# EAGLE board backplane (EAGLE 8.3.1), part 1 of 3
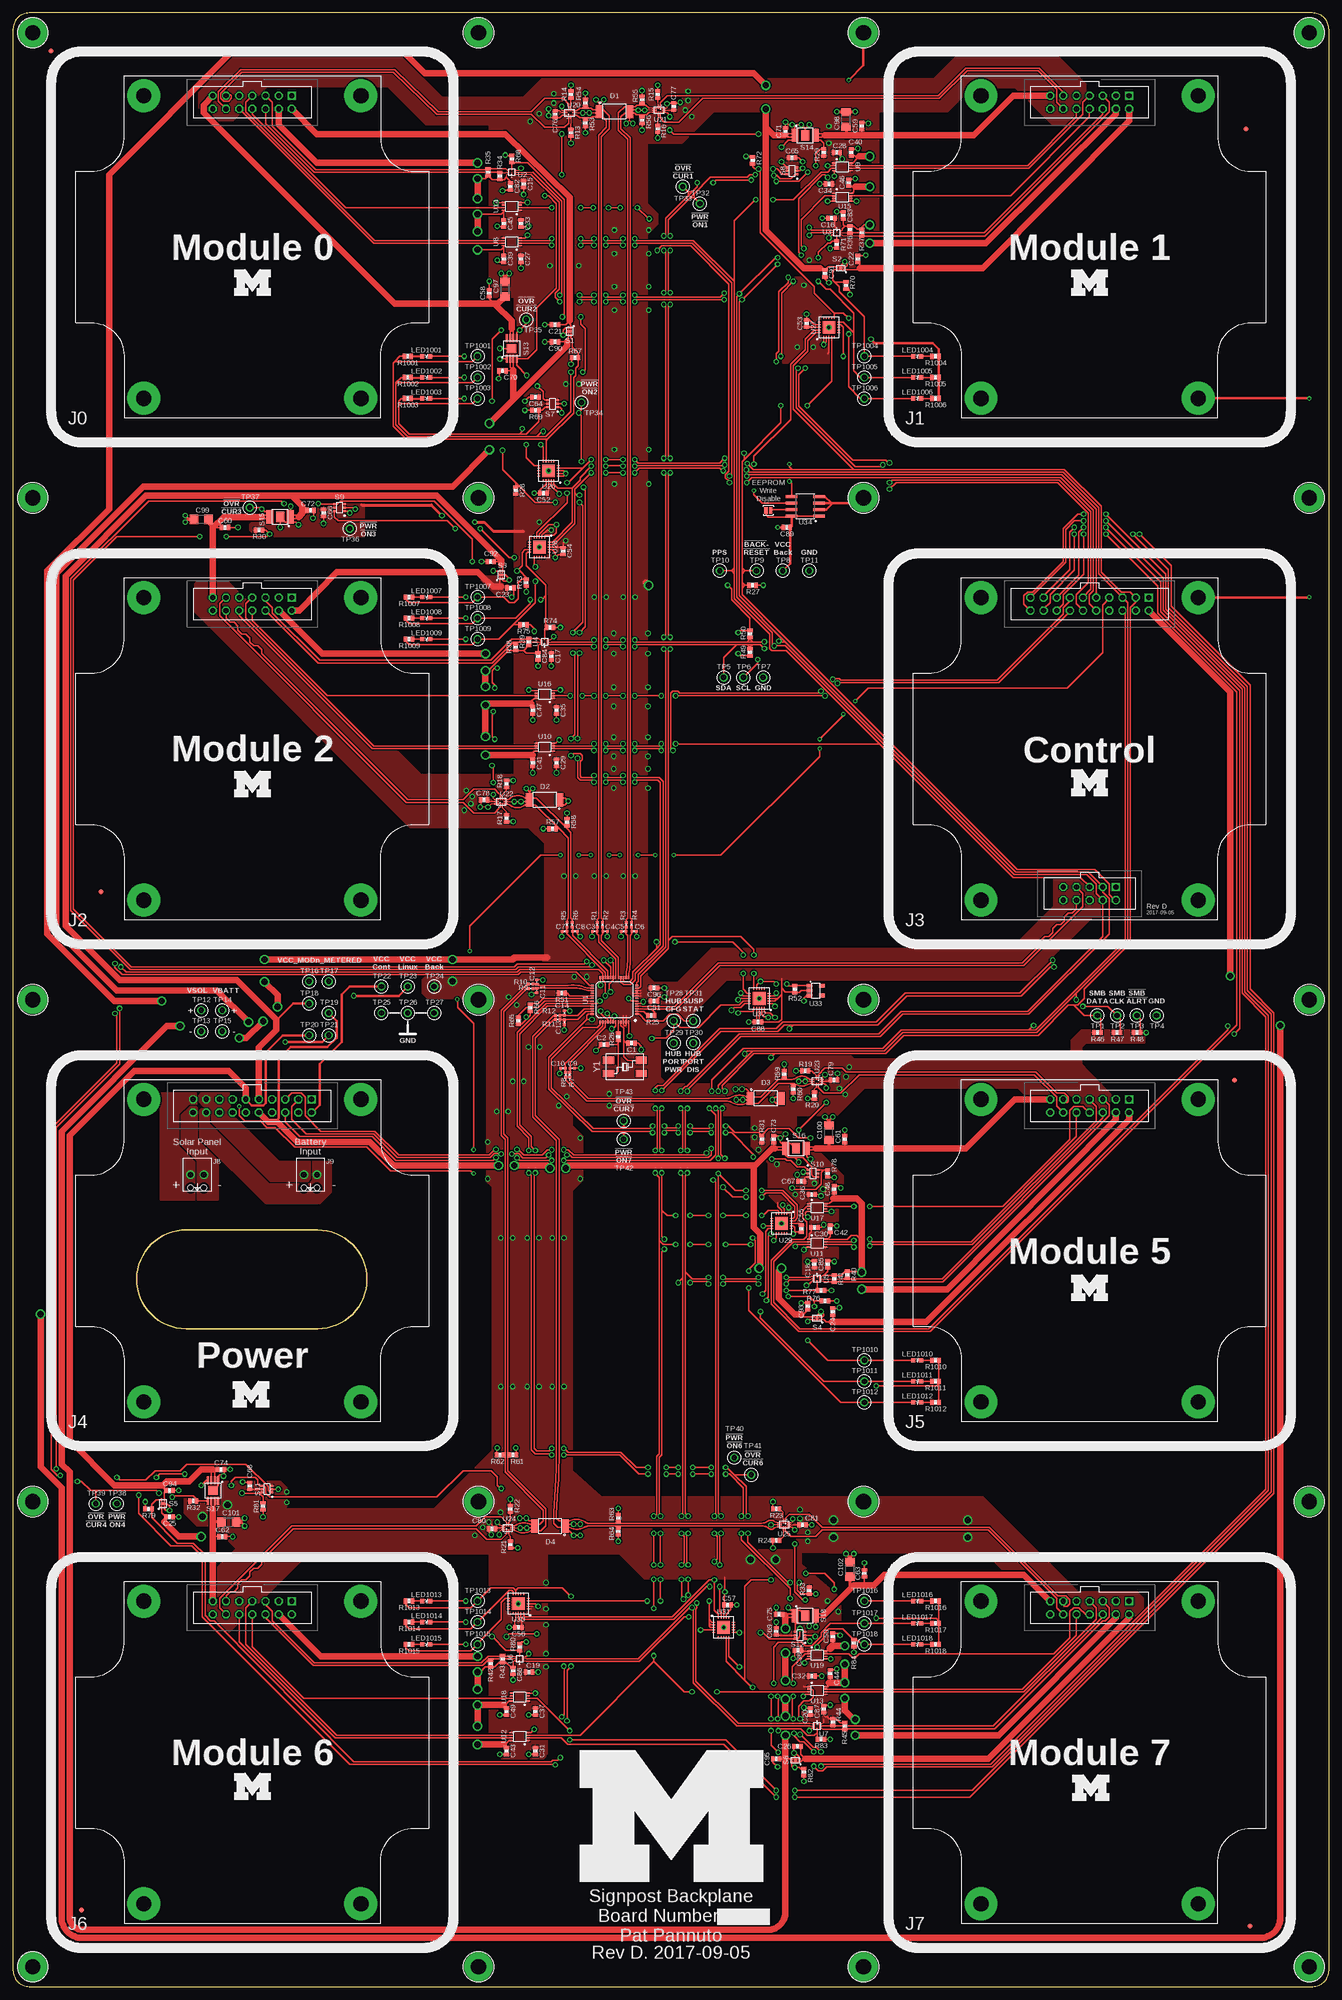
[diagram p10: board, top side]
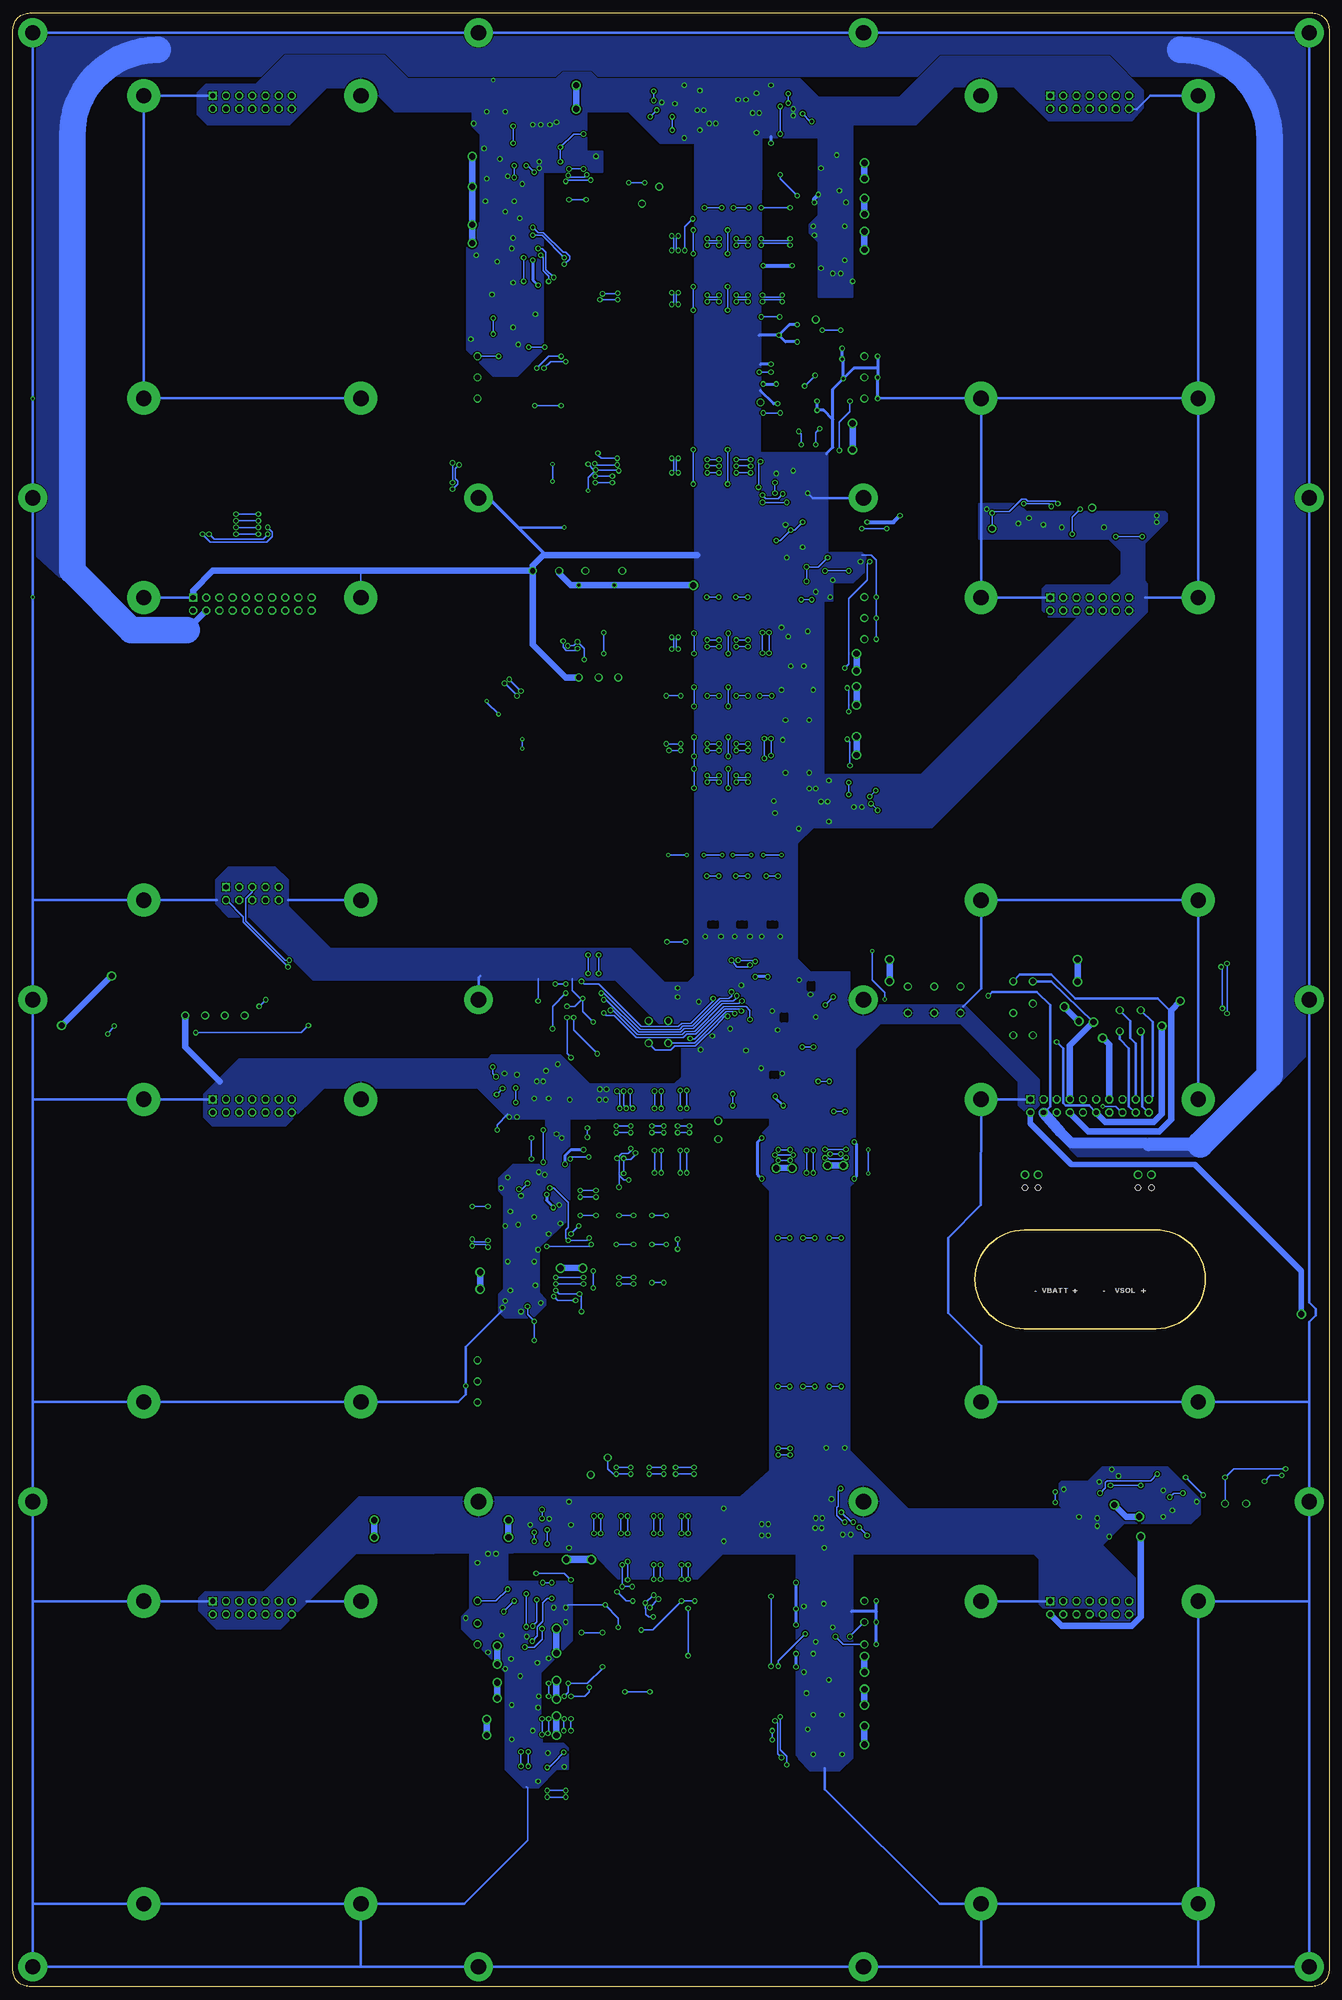
[diagram p11: board, bottom side, seen from below]

Size 254 x 381 mm. Coordinates in mm from the lower left corner, seen from the top.
Outline: 33.4,146.05 33.53,146.05
Outline: 33.53,146.05 58.8,146.05 arc-180 58.8,127 33.4,127 arc-181 33.53,146.05
Outline: 0,377.82 0,3.17 arc90 3.17,0 250.82,0 arc90 254,3.17 254,377.76 arc90 250.76,381 3.17,381 arc90 0,377.82
Copper layers (1*16): Top 0.0178mm / dielectric 59mil / Bottom 0.0178mm
Design rules "sunstone-2lyr_v1.0.0.3 *": minimum track width 6mil, minimum drill 14mil, track to track 6mil, track to pad 6mil, pad to pad 6mil, via to via 6mil, smd to smd 6mil, copper to edge 20mil, drill to drill 16mil, minimum pad ring 8mil, minimum via ring 8mil, stop-mask expansion 3mil, vias tented up to drill 50mil, thermal gap 10mil
tRestrict: area 120.2,191.5 to 120.5,191.5; area 118,186.1 to 118.1,186.4; area 99.2,73.1 to 99.6,73.2; area 99.2,72.6 to 99.6,72.7

## Footprints (pad centres in the part's own frame; a part is rotated, then mirrored left to right if it is on the bottom)
0603_CAP = smd 0.7 x 1: 1 -0.65,0; 2 0.65,0
0402_CAP = smd 0.536 x 0.546: 1 -0.433,0; 2 0.433,0
C1206 = smd 1.6 x 1.8: 1 -1.4,0; 2 1.4,0
TSSOP-8 = smd 1.5 x 0.45: 1 -2.9,0.975; 2 -2.9,0.325; 3 -2.9,-0.325; 4 -2.9,-0.975; 5 2.9,-0.975; 6 2.9,-0.325; 7 2.9,0.325; 8 2.9,0.975
#4-PAD = drill 2.946 pad 5.563: B#4 0,0
BACKPLANE_MODULE_14PIN = drill 1.016 square: 1 7.62,29.21 | drill 1.016 octagon: 2 7.62,26.67; 3 5.08,29.21; 4 5.08,26.67; 5 2.54,29.21; 6 2.54,26.67; 7 0,29.21; 8 0,26.67; 9 -2.54,29.21; 10 -2.54,26.67; 11 -5.08,29.21; 12 -5.08,26.67; 13 -7.62,29.21; 14 -7.62,26.67 | drill 2.946 pad 6.35: MNT1 -20.955,29.21; MNT2 20.955,29.21; MNT3 -20.955,-29.21; MNT4 20.955,-29.21
BACKPLANE_MODULE_20PIN_10PIN = drill 1.016 square: 1 11.43,29.21; 21 5.08,-26.67 | drill 1.016 octagon: 2 11.43,26.67; 3 8.89,29.21; 4 8.89,26.67; 5 6.35,29.21; 6 6.35,26.67; 7 3.81,29.21; 8 3.81,26.67; 9 1.27,29.21; 10 1.27,26.67; 11 -1.27,29.21; 12 -1.27,26.67; 13 -3.81,29.21; 14 -3.81,26.67; 15 -6.35,29.21; 16 -6.35,26.67; 17 -8.89,29.21; 18 -8.89,26.67; 19 -11.43,29.21; 20 -11.43,26.67; 22 5.08,-29.21; 23 2.54,-26.67; 24 2.54,-29.21; 25 0,-26.67; 26 0,-29.21; 27 -2.54,-26.67; 28 -2.54,-29.21; 29 -5.08,-26.67; 30 -5.08,-29.21 | drill 2.946 pad 6.35: MNT1 -20.955,29.21; MNT2 20.955,29.21; MNT3 20.955,-29.21; MNT4 -20.955,-29.21
BACKPLANE_MODULE_20PIN = drill 1.016 square: 1 11.43,29.21 | drill 1.016 octagon: 2 11.43,26.67; 3 8.89,29.21; 4 8.89,26.67; 5 6.35,29.21; 6 6.35,26.67; 7 3.81,29.21; 8 3.81,26.67; 9 1.27,29.21; 10 1.27,26.67; 11 -1.27,29.21; 12 -1.27,26.67; 13 -3.81,29.21; 14 -3.81,26.67; 15 -6.35,29.21; 16 -6.35,26.67; 17 -8.89,29.21; 18 -8.89,26.67; 19 -11.43,29.21; 20 -11.43,26.67 | drill 2.946 pad 6.35: MNT1 -20.955,29.21; MNT2 20.955,29.21; MNT3 -20.955,-29.21; MNT4 20.955,-29.21
CONN_BLOCK_2 = drill 1.1: 1 -1.27,0; 2 1.27,0 | hole 1.12: -1.27,-2.54; 1.27,-2.54
FIDUCIAL-1X2 = smd 1 x 1: 1 0,0
LED-0603 = smd 0.8 x 0.8: A 0,-0.75; C 0,0.75
0402_RES-HIGH_SPEED = smd 0.536 x 0.546: 1 -0.433,0; 2 0.433,0
0603-RES = smd 0.7 x 1: 1 -0.65,0; 2 0.65,0
TDFN4 = smd 0.3 x 0.55: 1 -0.25,-0.725; 2 0.25,-0.725; 3 0.25,0.725; 4 -0.25,0.725 | smd 0.86 x 0.5: PAD 0,0
SC70-6 = smd 0.4 x 0.5: 1 -0.65,-0.95; 2 0,-0.95; 3 0.65,-0.95; 4 0.65,0.95; 5 0,0.95; 6 -0.65,0.95
MSOP-8EP = smd 0.45 x 1.35: 1 -0.975,-1.975; 2 -0.325,-1.975; 3 0.325,-1.975; 4 0.975,-1.975; 5 0.975,1.975; 6 0.325,1.975; 7 -0.325,1.975; 8 -0.975,1.975 | smd 2 x 1.7: PAD 0,0
SJ_2S-NO = smd 0.635 x 1.27: 1 -0.45,0; 2 0.45,0
TESTPOINT_0.040IN = drill 1.016: TESTPOINT 0,0
LQFP-48 = smd 0.3 x 0.6: 1 -2.75,-4.3; 2 -2.25,-4.3; 3 -1.75,-4.3; 4 -1.25,-4.3; 5 -0.75,-4.3; 6 -0.25,-4.3; 7 0.25,-4.3; 8 0.75,-4.3; 9 1.25,-4.3; 10 1.75,-4.3; 11 2.25,-4.3; 12 2.75,-4.3; 25 2.75,4.3; 26 2.25,4.3; 27 1.75,4.3; 28 1.25,4.3; 29 0.75,4.3; 30 0.25,4.3; 31 -0.25,4.3; 32 -0.75,4.3; 33 -1.25,4.3; 34 -1.75,4.3; 35 -2.25,4.3; 36 -2.75,4.3 | smd 0.6 x 0.3: 13 4.3,-2.75; 14 4.3,-2.25; 15 4.3,-1.75; 16 4.3,-1.25; 17 4.3,-0.75; 18 4.3,-0.25; 19 4.3,0.25; 20 4.3,0.75; 21 4.3,1.25; 22 4.3,1.75; 23 4.3,2.25; 24 4.3,2.75; 37 -4.3,2.75; 38 -4.3,2.25; 39 -4.3,1.75; 40 -4.3,1.25; 41 -4.3,0.75; 42 -4.3,0.25; 43 -4.3,-0.25; 44 -4.3,-0.75; 45 -4.3,-1.25; 46 -4.3,-1.75; 47 -4.3,-2.25; 48 -4.3,-2.75
UMLP-8 = smd 0.35 x 0.25: 1 -0.55,0; 5 0.55,0 | smd 0.24 x 0.35: 2 -0.4,-0.625; 3 0,-0.625; 4 0.4,-0.625; 6 0.4,0.625; 7 0,0.625; 8 -0.4,0.625
VFSOP-8 = smd 0.25 x 0.75: 1 -0.75,-1.55; 2 -0.25,-1.55; 3 0.25,-1.55; 4 0.75,-1.55; 5 0.75,1.55; 6 0.25,1.55; 7 -0.25,1.55; 8 -0.75,1.55
UQFN-10 = smd 0.2 x 0.9: 1 -0.2,-0.65 | smd 0.2 x 0.8: 2 0.2,-0.7; 6 0.2,0.7; 7 -0.2,0.7 | smd 0.8 x 0.2: 3 0.9,-0.4; 4 0.9,0; 5 0.9,0.4; 8 -0.9,0.4; 9 -0.9,0; 10 -0.9,-0.4
QFN-20-4MM = smd 0.7 x 0.3: 1 -1.9,1; 2 -1.9,0.5; 3 -1.9,0; 4 -1.9,-0.5; 5 -1.9,-1; 11 1.9,-1; 12 1.9,-0.5; 13 1.9,0; 14 1.9,0.5; 15 1.9,1 | smd 0.3 x 0.7: 6 -1,-1.9; 7 -0.5,-1.9; 8 0,-1.9; 9 0.5,-1.9; 10 1,-1.9; 16 1,1.9; 17 0.5,1.9; 18 0,1.9; 19 -0.5,1.9; 20 -1,1.9 | smd 2.45 x 2.45: GND 0,0
SOT23-5 = smd 0.7 x 1: 1 0.95,1.2; 2 0,1.2; 3 -0.95,1.2; 4 -0.95,-1.2; 5 0.95,-1.2
SOIC-8 = smd 0.61 x 2.21: 1 -1.905,-2.616; 2 -0.635,-2.616; 3 0.635,-2.616; 4 1.905,-2.616; 5 1.905,2.616; 6 0.635,2.616; 7 -0.635,2.616; 8 -1.905,2.616
ABMM = smd 2.21 x 1.397: 1 -3.167,-1.27; 3 3.15,1.27; NC1 -3.15,1.27; NC2 3.15,-1.27

## Placement (x,y rotation side)
C1  22pF, 5% tol  [0603_CAP]  119.38,182.12 180 top
C2  22pF, 5% tol  [0603_CAP]  114.05,181.86 0 top
C3  22pF  [0402_CAP]  112.27,203.71 180 top
C4  22pF  [0402_CAP]  114.3,203.71 0 top
C5  22pF  [0402_CAP]  117.86,203.71 180 top
C6  22pF  [0402_CAP]  119.89,203.71 0 top
C7  22pF  [0402_CAP]  106.43,203.71 180 top
C8  22pF  [0402_CAP]  108.46,203.71 0 top
C9  22pF  [0402_CAP]  107.95,177.29 0 top
C10  22pF  [0402_CAP]  106.17,177.29 180 top
C11  22pF  [0402_CAP]  101.09,192.28 270 top
C12  22pF  [0402_CAP]  101.09,193.93 90 top
C13  22pF  [0402_CAP]  106.43,186.18 270 top
C14  22pF  [0402_CAP]  106.43,187.96 90 top
C15  100nF  [0603_CAP]  98.55,347.98 270 top
C16  100nF  [0603_CAP]  157.99,341.38 180 top
C17  100nF  [0603_CAP]  103.89,256.79 270 top
C18  100nF  [0603_CAP]  154.69,139.45 90 top
C19  100nF  [0603_CAP]  99.57,60.71 0 top
C20  100nF  [0603_CAP]  153.92,53.09 90 top
C21  100nF  [0603_CAP]  104.65,320.8 180 top
C22  100nF  [0603_CAP]  163.07,333.5 90 top
C23  100nF  [0603_CAP]  96.01,270 0 top
C24  100nF  [0603_CAP]  158.24,130.3 90 top
C25  100nF  [0603_CAP]  30.23,90.68 0 top
C26  100nF  [0603_CAP]  151.38,46.35 180 top
C27  100nF  [0603_CAP]  98.04,333.5 270 top
C28  100nF  [0603_CAP]  159,354.08 0 top
C29  100nF  [0603_CAP]  104.9,236.22 270 top
C30  100nF  [0603_CAP]  154.69,146.56 0 top
C31  100nF  [0603_CAP]  100.84,45.47 270 top
C32  100nF  [0603_CAP]  154.18,59.94 0 top
C33  100nF  [0603_CAP]  98.04,340.36 270 top
C34  100nF  [0603_CAP]  157.48,347.98 180 top
C35  100nF  [0603_CAP]  104.9,246.38 270 top
C36  100nF  [0603_CAP]  154.18,152.91 0 top
C37  100nF  [0603_CAP]  100.84,53.09 270 top
C38  100nF  [0603_CAP]  151.51,64.9 180 top
C39  100nF  [0603_CAP]  94.74,333.5 270 top
C40  100nF  [0603_CAP]  161.8,354.08 90 top
C41  100nF  [0603_CAP]  100.33,236.22 270 top
C42  100nF  [0603_CAP]  157.73,146.3 90 top
C43  100nF  [0603_CAP]  95.25,45.47 270 top
C44  100nF  [0603_CAP]  157.73,60.45 90 top
C45  100nF  [0603_CAP]  94.74,340.36 270 top
C46  100nF  [0603_CAP]  161.29,348.23 90 top
C47  100nF  [0603_CAP]  100.33,246.38 270 top
C48  100nF  [0603_CAP]  158.5,153.92 90 top
C49  100nF  [0603_CAP]  95.25,53.09 270 top
C50  100nF  [0603_CAP]  158.24,67.56 90 top
C51  100nF  [0603_CAP]  123.7,190.25 180 top
C52  100nF  [0603_CAP]  102.36,288.29 180 top
C53  100nF  [0603_CAP]  153.16,321.06 90 top
C54  100nF  [0603_CAP]  106.17,277.11 270 top
C55  100nF  [0603_CAP]  152.15,146.3 270 top
C56  100nF  [0603_CAP]  97.54,69.34 180 top
C57  100nF  [0603_CAP]  137.92,73.66 0 top
C58  100nF  [0603_CAP]  91.95,326.9 90 top
C59  100nF  [0603_CAP]  163.83,359.16 90 top
C60  100nF  [0603_CAP]  40.89,281.69 0 top
C61  100nF  [0603_CAP]  160.53,163.58 90 top
C62  100nF  [0603_CAP]  40.39,86.87 0 top
C63  100nF  [0603_CAP]  164.34,79.76 90 top
C64  100nF  [0603_CAP]  100.84,306.83 180 top
C65  100nF  [0603_CAP]  150.37,353.06 0 top
C66  100nF  [0603_CAP]  59.94,284.48 270 top
C67  100nF  [0603_CAP]  152.15,155.45 180 top
C68  100nF  [0603_CAP]  45.72,96.65 90 top
C69  100nF  [0603_CAP]  147.32,68.58 90 top
C70  100nF  [0603_CAP]  94.49,311.91 180 top
C71  100nF  [0603_CAP]  149.1,358.14 90 top
C72  100nF  [0603_CAP]  57.4,284.99 0 top
C73  100nF  [0603_CAP]  146.81,163.58 90 top
C74  100nF  [0603_CAP]  40.13,99.82 0 top
C75  100nF  [0603_CAP]  147.83,71.88 180 top
C76  100nF  [0603_CAP]  104.65,361.44 90 top
C77  100nF  [0603_CAP]  127.51,362.97 270 top
C78  100nF  [0603_CAP]  90.93,229.11 0 top
C79  100nF  [0603_CAP]  158.47,175.01 180 top
C80  100nF  [0603_CAP]  92.46,88.39 0 top
C81  100nF  [0603_CAP]  152.4,89.15 180 top
C82  100nF  [0603_CAP]  96.01,347.47 270 top
C83  100nF  [0603_CAP]  160.27,341.88 90 top
C84  100nF  [0603_CAP]  101.35,256.79 270 top
C85  100nF  [0603_CAP]  157.23,139.45 90 top
C86  100nF  [0603_CAP]  96.52,60.96 270 top
C87  100nF  [0603_CAP]  156.46,53.59 90 top
C88  100nF  [0603_CAP]  143.76,186.18 180 top
C89  100nF  [0603_CAP]  149.35,281.69 180 top
C90  4.7uF  [0603_CAP]  104.65,317.5 180 top
C91  4.7uF  [0603_CAP]  156.72,330.71 270 top
C92  4.7uF  [0603_CAP]  92.2,275.08 180 top
C93  4.7uF  [0603_CAP]  153.42,131.32 90 top
C94  4.7uF  [0603_CAP]  30.23,95.76 0 top
C95  4.7uF  [0603_CAP]  147.32,43.94 180 top
C96  4.7uF  [0603_CAP]  123.7,192.79 180 top
C97  150uF  [C1206]  95,327.66 90 top
C98  150uF  [C1206]  160.78,360.43 90 top
C99  150uF  [C1206]  36.32,283.21 180 top
C100  150uF  [C1206]  157.48,164.85 90 top
C101  150uF  [C1206]  41.66,89.66 0 top
C102  150uF  [C1206]  161.54,80.52 90 top
D1  SN75240-TSSOP  [TSSOP-8]  116.08,361.95 0 top
D2  SN75240-TSSOP  [TSSOP-8]  102.62,229.11 180 top
D3  SN75240-TSSOP  [TSSOP-8]  145.29,171.45 0 top
D4  SN75240-TSSOP  [TSSOP-8]  103.63,88.9 180 top
H1  MOUNT-PAD-ROUND#4  [#4-PAD]  3.81,377.19 0 top
H2  MOUNT-PAD-ROUND#4  [#4-PAD]  89.87,377.19 0 top
H3  MOUNT-PAD-ROUND#4  [#4-PAD]  164.13,377.19 0 top
H4  MOUNT-PAD-ROUND#4  [#4-PAD]  250.19,377.19 0 top
H5  MOUNT-PAD-ROUND#4  [#4-PAD]  3.81,287.38 0 top
H6  MOUNT-PAD-ROUND#4  [#4-PAD]  89.87,287.38 0 top
H7  MOUNT-PAD-ROUND#4  [#4-PAD]  164.13,287.38 0 top
H8  MOUNT-PAD-ROUND#4  [#4-PAD]  250.19,287.38 0 top
H9  MOUNT-PAD-ROUND#4  [#4-PAD]  3.81,190.5 0 top
H10  MOUNT-PAD-ROUND#4  [#4-PAD]  89.87,190.5 0 top
H11  MOUNT-PAD-ROUND#4  [#4-PAD]  164.13,190.5 0 top
H12  MOUNT-PAD-ROUND#4  [#4-PAD]  250.19,190.5 0 top
H13  MOUNT-PAD-ROUND#4  [#4-PAD]  3.81,93.62 0 top
H14  MOUNT-PAD-ROUND#4  [#4-PAD]  89.87,93.62 0 top
H15  MOUNT-PAD-ROUND#4  [#4-PAD]  164.13,93.62 0 top
H16  MOUNT-PAD-ROUND#4  [#4-PAD]  250.19,93.62 0 top
H17  MOUNT-PAD-ROUND#4  [#4-PAD]  3.81,3.81 0 top
H18  MOUNT-PAD-ROUND#4  [#4-PAD]  89.87,3.81 0 top
H19  MOUNT-PAD-ROUND#4  [#4-PAD]  164.13,3.81 0 top
H20  MOUNT-PAD-ROUND#4  [#4-PAD]  250.19,3.81 0 top
J0  BACKPLANE_GENERIC_MODULE  [BACKPLANE_MODULE_14PIN]  46.2,335.81 0 top
J1  BACKPLANE_GENERIC_MODULE  [BACKPLANE_MODULE_14PIN]  207.8,335.81 0 top
J2  BACKPLANE_GENERIC_MODULE  [BACKPLANE_MODULE_14PIN]  46.2,238.94 0 top
J3  BACKPLANE_CONTROLLER_MODULE  [BACKPLANE_MODULE_20PIN_10PIN]  207.8,238.94 0 top
J4  BACKPLANE_POWER_MODULE  [BACKPLANE_MODULE_20PIN]  46.2,142.06 0 top
J5  BACKPLANE_GENERIC_MODULE  [BACKPLANE_MODULE_14PIN]  207.8,142.06 0 top
J6  BACKPLANE_GENERIC_MODULE  [BACKPLANE_MODULE_14PIN]  46.2,45.19 0 top
J7  BACKPLANE_GENERIC_MODULE  [BACKPLANE_MODULE_14PIN]  207.8,45.19 0 top
J8  SCREW-TERMINAL_2_0.100  [CONN_BLOCK_2]  35.56,156.72 0 top
J9  SCREW-TERMINAL_2_0.100  [CONN_BLOCK_2]  57.4,156.72 0 top
JP1  FIDUCIAL1X2  [FIDUCIAL-1X2]  13.21,14.73 0 top
JP2  FIDUCIAL1X2  [FIDUCIAL-1X2]  238.76,11.68 0 top
JP3  FIDUCIAL1X2  [FIDUCIAL-1X2]  7.37,373.63 0 top
JP4  FIDUCIAL1X2  [FIDUCIAL-1X2]  238,358.65 0 top
JP5  FIDUCIAL1X2  [FIDUCIAL-1X2]  17.02,211.33 0 top
JP6  FIDUCIAL1X2  [FIDUCIAL-1X2]  235.71,175.01 0 top
LED1001  LED0603  [LED-0603]  79.76,314.71 270 top
LED1002  LED0603  [LED-0603]  79.76,310.64 270 top
LED1003  LED0603  [LED-0603]  79.76,306.58 270 top
LED1004  LED0603  [LED-0603]  174.5,314.71 270 top
LED1005  LED0603  [LED-0603]  174.5,310.64 270 top
LED1006  LED0603  [LED-0603]  174.5,306.58 270 top
LED1007  LED0603  [LED-0603]  79.76,268.22 270 top
LED1008  LED0603  [LED-0603]  79.76,264.16 270 top
LED1009  LED0603  [LED-0603]  79.76,260.1 270 top
LED1010  LED0603  [LED-0603]  174.5,120.9 270 top
LED1011  LED0603  [LED-0603]  174.5,116.84 270 top
LED1012  LED0603  [LED-0603]  174.5,112.78 270 top
LED1013  LED0603  [LED-0603]  79.76,74.42 270 top
LED1014  LED0603  [LED-0603]  79.76,70.36 270 top
LED1015  LED0603  [LED-0603]  79.76,66.04 270 top
LED1016  LED0603  [LED-0603]  174.5,74.42 270 top
LED1017  LED0603  [LED-0603]  174.5,70.1 270 top
LED1018  LED0603  [LED-0603]  174.5,66.04 270 top
LOGO1  UMICH_SOLID_GIANT  [UMICH_SOLID_1000MIL]  109.35,20.19 0 top
LOGO2  UMICH_SOLID_MEDIUM  [UMICH_SOLID_200MIL]  42.67,326.39 0 top
LOGO3  UMICH_SOLID_MEDIUM  [UMICH_SOLID_200MIL]  204.22,326.39 0 top
LOGO4  UMICH_SOLID_MEDIUM  [UMICH_SOLID_200MIL]  42.67,229.62 0 top
LOGO5  UMICH_SOLID_MEDIUM  [UMICH_SOLID_200MIL]  204.22,132.33 0 top
LOGO6  UMICH_SOLID_MEDIUM  [UMICH_SOLID_200MIL]  42.67,36.07 0 top
LOGO7  UMICH_SOLID_MEDIUM  [UMICH_SOLID_200MIL]  204.47,35.81 0 top
LOGO8  UMICH_SOLID_MEDIUM  [UMICH_SOLID_200MIL]  204.22,229.87 0 top
LOGO9  UMICH_SOLID_MEDIUM  [UMICH_SOLID_200MIL]  42.42,111.76 0 top
R1  27Ω  [0402_RES-HIGH_SPEED]  112.78,204.98 90 top
R2  27Ω  [0402_RES-HIGH_SPEED]  113.79,204.98 90 top
R3  27Ω  [0402_RES-HIGH_SPEED]  118.36,204.98 90 top
R4  27Ω  [0402_RES-HIGH_SPEED]  119.38,204.98 90 top
R5  27Ω  [0402_RES-HIGH_SPEED]  106.93,204.98 90 top
R6  27Ω  [0402_RES-HIGH_SPEED]  107.95,204.98 90 top
R7  27Ω  [0402_RES-HIGH_SPEED]  107.44,176.02 270 top
R8  27Ω  [0402_RES-HIGH_SPEED]  106.68,176.02 270 top
R9  27Ω  [0402_RES-HIGH_SPEED]  99.95,192.66 180 top
R10  27Ω  [0402_RES-HIGH_SPEED]  99.95,193.55 180 top
R11  27Ω  [0402_RES-HIGH_SPEED]  105.16,186.69 180 top
R12  27Ω  [0402_RES-HIGH_SPEED]  105.16,187.45 180 top
R13  50Ω  [0603-RES]  107.7,357.89 270 top
R14  50Ω  [0603-RES]  107.7,365.25 90 top
R15  50Ω  [0603-RES]  124.46,365.25 90 top
R16  50Ω  [0603-RES]  124.46,358.65 270 top
R17  50Ω  [0603-RES]  95.25,225.55 270 top
R18  50Ω  [0603-RES]  95.25,232.16 90 top
R19  50Ω  [0603-RES]  152.91,176.78 180 top
R20  50Ω  [0603-RES]  154.69,171.96 270 top
R21  50Ω  [0603-RES]  96.01,85.34 270 top
R22  50Ω  [0603-RES]  96.01,92.2 90 top
R23  50Ω  [0603-RES]  147.32,92.2 180 top
R24  50Ω  [0603-RES]  147.32,86.11 180 top
R25  1.5kΩ  [0603-RES]  123.19,187.45 180 top
R26  1.5kΩ  [0603-RES]  116.84,183.39 90 top
R27  1.5kΩ  [0603-RES]  142.75,270.51 180 top
R28  10kΩ  [0603-RES]  97.03,288.8 270 top
R29  10kΩ  [0603-RES]  156.46,354.08 270 top
R30  10kΩ  [0603-RES]  47.5,281.18 180 top
R31  10kΩ  [0603-RES]  144.53,163.58 270 top
R32  10kΩ  [0603-RES]  34.8,93.73 180 top
R33  10kΩ  [0603-RES]  153.67,76.45 90 top
R34  10kΩ  [0603-RES]  93.98,349.5 90 top
R35  10kΩ  [0603-RES]  91.69,350.27 90 top
R36  10kΩ  [0603-RES]  161.54,339.22 270 top
R37  10kΩ  [0603-RES]  163.83,338.58 270 top
R38  10kΩ  [0603-RES]  97.03,258.57 90 top
R39  10kΩ  [0603-RES]  99.57,259.59 90 top
R40  10kΩ  [0603-RES]  161.04,137.41 270 top
R41  10kΩ  [0603-RES]  158.5,136.65 270 top
R42  10kΩ  [0603-RES]  92.2,62.36 90 top
R43  10kΩ  [0603-RES]  94.49,63.25 90 top
R44  10kΩ  [0603-RES]  158.24,51.05 270 top
R45  10kΩ  [0603-RES]  160.53,50.29 270 top
R46  10kΩ  [0603-RES]  209.3,184.15 180 top
R47  10kΩ  [0603-RES]  213.11,184.15 180 top
R48  10kΩ  [0603-RES]  216.92,184.15 180 top
R49  10kΩ  [0603-RES]  142.24,257.56 270 top
R50  10kΩ  [0603-RES]  142.24,261.11 90 top
R51  10kΩ  [0603-RES]  105.92,191.77 180 top
R52  10kΩ  [0603-RES]  150.88,192.53 270 top
R53  15kΩ  [0603-RES]  110.49,359.79 90 top
R54  15kΩ  [0603-RES]  110.49,363.6 270 top
R55  15kΩ  [0603-RES]  121.41,364.24 270 top
R56  15kΩ  [0603-RES]  121.41,360.3 90 top
R57  15kΩ  [0603-RES]  104.14,223.52 0 top
R58  15kΩ  [0603-RES]  106.93,224.79 270 top
R59  15kΩ  [0603-RES]  148.84,176.15 270 top
R60  15kΩ  [0603-RES]  150.62,173.23 90 top
R61  15kΩ  [0603-RES]  96.52,102.62 180 top
R62  15kΩ  [0603-RES]  93.98,102.62 0 top
R63  15kΩ  [0603-RES]  116.84,90.42 270 top
R64  15kΩ  [0603-RES]  116.84,87.88 90 top
R65  15kΩ  [0603-RES]  97.54,186.44 270 top
R66  15kΩ  [0603-RES]  99.82,188.98 270 top
R67  10MΩ  [0603-RES]  108.46,314.45 0 top
R68  10MΩ  [0603-RES]  96.27,352.81 270 top
R69  10MΩ  [0603-RES]  100.84,304.29 0 top
R70  10MΩ  [0603-RES]  160.78,328.42 90 top
R71  10MΩ  [0603-RES]  159,336.3 90 top
R72  10MΩ  [0603-RES]  142.75,352.55 270 top
R73  10MΩ  [0603-RES]  99.06,271.02 90 top
R74  10MΩ  [0603-RES]  103.63,262.38 180 top
R75  10MΩ  [0603-RES]  98.55,262.89 180 top
R76  10MΩ  [0603-RES]  156.72,132.33 180 top
R77  10MΩ  [0603-RES]  155.96,134.37 180 top
R78  10MΩ  [0603-RES]  157.23,156.97 90 top
R79  10MΩ  [0603-RES]  26.16,92.2 0 top
R80  10MΩ  [0603-RES]  97.79,65.53 270 top
R81  10MΩ  [0603-RES]  48.26,92.71 90 top
R82  10MΩ  [0603-RES]  152.65,41.4 90 top
R83  10MΩ  [0603-RES]  155.96,47.75 180 top
R84  10MΩ  [0603-RES]  162.31,66.29 90 top
R1001  15Ω  [0603-RES]  76.2,314.71 180 top
R1002  15Ω  [0603-RES]  76.2,310.64 180 top
R1003  15Ω  [0603-RES]  76.2,306.58 180 top
R1004  15Ω  [0603-RES]  178.05,314.71 180 top
R1005  15Ω  [0603-RES]  178.05,310.64 180 top
R1006  15Ω  [0603-RES]  178.05,306.58 180 top
R1007  15Ω  [0603-RES]  76.45,268.22 180 top
R1008  15Ω  [0603-RES]  76.45,264.16 180 top
R1009  15Ω  [0603-RES]  76.45,260.1 180 top
R1010  15Ω  [0603-RES]  178.05,120.9 180 top
R1011  15Ω  [0603-RES]  178.05,116.84 180 top
R1012  15Ω  [0603-RES]  178.05,112.78 180 top
R1013  15Ω  [0603-RES]  76.45,74.42 180 top
R1014  15Ω  [0603-RES]  76.45,70.36 180 top
R1015  15Ω  [0603-RES]  76.45,66.04 180 top
R1016  15Ω  [0603-RES]  178.05,74.42 180 top
R1017  15Ω  [0603-RES]  178.05,70.1 180 top
R1018  15Ω  [0603-RES]  178.05,66.04 180 top
S1  SIP3240X  [TDFN4]  107.44,319.53 180 top
S2  SIP3240X  [TDFN4]  159.77,331.72 90 top
S3  SIP3240X  [TDFN4]  94.23,272.54 0 top
S4  SIP3240X  [TDFN4]  155.19,129.03 90 top
S5  SIP3240X  [TDFN4]  28.96,93.22 0 top
S6  SIP3240X  [TDFN4]  151,43.69 90 top
S7  NC7SZ157  [SC70-6]  104.14,305.56 90 top
S8  NC7SZ157  [SC70-6]  150.37,350.52 90 top
S9  NC7SZ157  [SC70-6]  62.99,285.5 90 top
S10  NC7SZ157  [SC70-6]  154.43,156.97 270 top
S11  NC7SZ157  [SC70-6]  49.02,96.01 90 top
S12  NC7SZ157  [SC70-6]  151.89,67.82 90 top
S13  AP2401MP  [MSOP-8EP]  96.27,316.23 0 top
S14  AP2401MP  [MSOP-8EP]  152.91,357.38 270 top
S15  AP2401MP  [MSOP-8EP]  51.56,283.72 90 top
S16  AP2401MP  [MSOP-8EP]  151.13,161.8 270 top
S17  AP2401MP  [MSOP-8EP]  38.61,95.76 180 top
S18  AP2401MP  [MSOP-8EP]  152.91,71.63 270 top
SJ1  SOLDERJUMPERNO  [SJ_2S-NO]  145.8,284.99 0 top
TP1  TEST_POINT_0.040IN  [TESTPOINT_0.040IN]  209.3,187.45 0 top
TP2  TEST_POINT_0.040IN  [TESTPOINT_0.040IN]  213.11,187.45 0 top
TP3  TEST_POINT_0.040IN  [TESTPOINT_0.040IN]  216.92,187.45 0 top
TP4  TEST_POINT_0.040IN  [TESTPOINT_0.040IN]  220.73,187.45 0 top
TP5  TEST_POINT_0.040IN  [TESTPOINT_0.040IN]  137.16,252.73 0 top
TP6  TEST_POINT_0.040IN  [TESTPOINT_0.040IN]  140.97,252.73 0 top
TP7  TEST_POINT_0.040IN  [TESTPOINT_0.040IN]  144.78,252.73 0 top
TP8  TEST_POINT_0.040IN  [TESTPOINT_0.040IN]  148.59,273.3 0 top
TP9  TEST_POINT_0.040IN  [TESTPOINT_0.040IN]  143.51,273.3 0 top
TP10  TEST_POINT_0.040IN  [TESTPOINT_0.040IN]  136.4,273.3 0 top
TP11  TEST_POINT_0.040IN  [TESTPOINT_0.040IN]  153.67,273.3 0 top
TP12  TEST_POINT_0.040IN  [TESTPOINT_0.040IN]  36.32,188.47 0 top
TP13  TEST_POINT_0.040IN  [TESTPOINT_0.040IN]  36.32,184.4 0 top
TP14  TEST_POINT_0.040IN  [TESTPOINT_0.040IN]  40.39,188.47 0 top
TP15  TEST_POINT_0.040IN  [TESTPOINT_0.040IN]  40.39,184.4 0 top
TP16  TEST_POINT_0.040IN  [TESTPOINT_0.040IN]  57.15,194.06 0 top
TP17  TEST_POINT_0.040IN  [TESTPOINT_0.040IN]  60.96,194.06 0 top
TP18  TEST_POINT_0.040IN  [TESTPOINT_0.040IN]  57.15,189.74 0 top
TP19  TEST_POINT_0.040IN  [TESTPOINT_0.040IN]  60.96,187.96 0 top
TP20  TEST_POINT_0.040IN  [TESTPOINT_0.040IN]  57.15,183.64 0 top
TP21  TEST_POINT_0.040IN  [TESTPOINT_0.040IN]  60.96,183.64 0 top
TP22  TEST_POINT_0.040IN  [TESTPOINT_0.040IN]  71.12,193.04 0 top
TP23  TEST_POINT_0.040IN  [TESTPOINT_0.040IN]  76.2,193.04 0 top
TP24  TEST_POINT_0.040IN  [TESTPOINT_0.040IN]  81.28,193.04 0 top
TP25  TEST_POINT_0.040IN  [TESTPOINT_0.040IN]  71.12,187.96 0 top
TP26  TEST_POINT_0.040IN  [TESTPOINT_0.040IN]  76.2,187.96 0 top
TP27  TEST_POINT_0.040IN  [TESTPOINT_0.040IN]  81.28,187.96 0 top
TP28  TEST_POINT_0.040IN  [TESTPOINT_0.040IN]  127.51,186.44 0 top
TP29  TEST_POINT_0.040IN  [TESTPOINT_0.040IN]  127.51,182.12 0 top
TP30  TEST_POINT_0.040IN  [TESTPOINT_0.040IN]  131.32,182.12 0 top
TP31  TEST_POINT_0.040IN  [TESTPOINT_0.040IN]  131.32,186.44 0 top
TP32  TEST_POINT_0.040IN  [TESTPOINT_0.040IN]  132.59,344.17 0 top
TP33  TEST_POINT_0.040IN  [TESTPOINT_0.040IN]  129.29,347.47 0 top
TP34  TEST_POINT_0.040IN  [TESTPOINT_0.040IN]  109.73,305.82 0 top
TP35  TEST_POINT_0.040IN  [TESTPOINT_0.040IN]  99.06,321.82 0 top
TP36  TEST_POINT_0.040IN  [TESTPOINT_0.040IN]  65.02,281.43 180 top
TP37  TEST_POINT_0.040IN  [TESTPOINT_0.040IN]  45.72,285.5 0 top
TP38  TEST_POINT_0.040IN  [TESTPOINT_0.040IN]  20.07,93.22 0 top
TP39  TEST_POINT_0.040IN  [TESTPOINT_0.040IN]  16,93.22 0 top
TP40  TEST_POINT_0.040IN  [TESTPOINT_0.040IN]  139.19,102.11 0 top
TP41  TEST_POINT_0.040IN  [TESTPOINT_0.040IN]  142.49,98.81 0 top
TP42  TEST_POINT_0.040IN  [TESTPOINT_0.040IN]  117.86,163.58 180 top
TP43  TEST_POINT_0.040IN  [TESTPOINT_0.040IN]  117.86,167.13 0 top
TP1001  TEST_POINT_0.040IN  [TESTPOINT_0.040IN]  89.66,314.71 0 top
TP1002  TEST_POINT_0.040IN  [TESTPOINT_0.040IN]  89.66,310.64 0 top
TP1003  TEST_POINT_0.040IN  [TESTPOINT_0.040IN]  89.66,306.58 0 top
TP1004  TEST_POINT_0.040IN  [TESTPOINT_0.040IN]  164.34,314.71 0 top
TP1005  TEST_POINT_0.040IN  [TESTPOINT_0.040IN]  164.34,310.64 0 top
TP1006  TEST_POINT_0.040IN  [TESTPOINT_0.040IN]  164.34,306.58 0 top
TP1007  TEST_POINT_0.040IN  [TESTPOINT_0.040IN]  89.66,268.22 0 top
TP1008  TEST_POINT_0.040IN  [TESTPOINT_0.040IN]  89.66,264.16 0 top
TP1009  TEST_POINT_0.040IN  [TESTPOINT_0.040IN]  89.66,260.1 0 top
TP1010  TEST_POINT_0.040IN  [TESTPOINT_0.040IN]  164.34,120.9 0 top
TP1011  TEST_POINT_0.040IN  [TESTPOINT_0.040IN]  164.34,116.84 0 top
TP1012  TEST_POINT_0.040IN  [TESTPOINT_0.040IN]  164.34,112.78 0 top
TP1013  TEST_POINT_0.040IN  [TESTPOINT_0.040IN]  89.66,74.42 0 top
TP1014  TEST_POINT_0.040IN  [TESTPOINT_0.040IN]  89.66,70.36 0 top
TP1015  TEST_POINT_0.040IN  [TESTPOINT_0.040IN]  89.66,66.04 0 top
TP1016  TEST_POINT_0.040IN  [TESTPOINT_0.040IN]  164.34,74.42 0 top
TP1017  TEST_POINT_0.040IN  [TESTPOINT_0.040IN]  164.34,70.1 0 top
TP1018  TEST_POINT_0.040IN  [TESTPOINT_0.040IN]  164.34,66.04 0 top
U1  TUSB2077A  [LQFP-48]  116.08,190.5 90 top
U2  FXMA2102  [UMLP-8]  96.27,350.27 90 top
U3  FXMA2102  [UMLP-8]  159,338.58 270 top
U4  FXMA2102  [UMLP-8]  102.62,259.59 90 top
U5  FXMA2102  [UMLP-8]  155.19,136.65 270 top
U6  FXMA2102  [UMLP-8]  97.79,63.25 90 top
U7  FXMA2102  [UMLP-8]  155.19,50.29 270 top
U8  SN74LVC2T45  [VFSOP-8]  96.27,336.8 90 top
U9  SN74LVC2T45  [VFSOP-8]  160.02,351.28 270 top
U10  SN74LVC2T45  [VFSOP-8]  102.62,239.27 90 top
U11  SN74LVC2T45  [VFSOP-8]  155.19,143.51 270 top
U12  SN74LVC2T45  [VFSOP-8]  97.79,48.26 90 top
U13  SN74LVC2T45  [VFSOP-8]  155.19,57.15 270 top
U14  SN74LVC2T45  [VFSOP-8]  96.27,343.66 90 top
U15  SN74LVC2T45  [VFSOP-8]  160.02,345.44 270 top
U16  SN74LVC2T45  [VFSOP-8]  102.62,249.43 90 top
U17  SN74LVC2T45  [VFSOP-8]  155.19,150.37 270 top
U18  SN74LVC2T45  [VFSOP-8]  97.79,55.88 90 top
U19  SN74LVC2T45  [VFSOP-8]  155.19,64.01 270 top
U20  TS3USB30E  [UQFN-10]  107.44,361.7 0 top
U21  TS3USB30E  [UQFN-10]  124.71,362.2 180 top
U22  TS3USB30E  [UQFN-10]  94.23,228.73 0 top
U23  TS3USB30E  [UQFN-10]  155.19,174.75 180 top
U24  TS3USB30E  [UQFN-10]  95.5,88.52 0 top
U25  TS3USB30E  [UQFN-10]  148.84,89.15 180 top
U26  MCP23008QFN  [QFN-20-4MM]  103.38,292.61 180 top
U27  MCP23008QFN  [QFN-20-4MM]  157.48,320.29 90 top
U28  MCP23008QFN  [QFN-20-4MM]  101.6,277.88 270 top
U29  MCP23008QFN  [QFN-20-4MM]  148.34,147.32 270 top
U30  MCP23008QFN  [QFN-20-4MM]  97.54,73.91 180 top
U31  MCP23008QFN  [QFN-20-4MM]  137.16,69.34 0 top
U32  MCP23008QFN  [QFN-20-4MM]  144.02,190.75 180 top
U33  NCP301LSN30  [SOT23-5]  154.94,192.28 90 top
U34  M24C01WMN  [SOIC-8]  152.91,285.75 90 top
Y1  ABMM  [ABMM]  118.11,177.55 0 top

## Tracks (layer width: path | path; a pad name or v marks a point on that pad's centre or on a via)
!BACKPLANE_RESET  (via drill 0.6)
  Top 0.254: J3.22 212.67,209.73 211.58,210.82 211.58,212.85 208.79,215.65 193.8,215.65 140.72,268.73 140.72,270 | v200.91,196.85 200.15,196.85 194.56,191.26 172.47,191.26 166.88,185.67 150.62,185.67 | v125.22,169.54 124.84,169.16 124.84,161.8 v125.22,161.42 | v125.22,157.1 125.22,149.86 | 125.22,149.86 126.24,148.84 v127.89,148.84 | v130.68,148.84 v134.24,148.84 | 125.22,149.86 125.22,144.78 v125.73,144.27 | v125.73,142.37 125.22,141.86 125.22,102.62 124.71,102.11 124.71,91.06 v124.97,90.81 | v124.97,87.5 v124.97,81.41 | v124.97,78.61 v124.97,74.42 | 140.72,270 140.72,271.02 | 140.72,271.02 140.72,272.8 | 140.72,272.8 140.72,273.81 | 140.72,273.81 140.72,294.39 141.1,294.77 | 141.1,294.77 148.21,301.88 v148.21,305.18 | 141.1,294.77 v141.1,296.04 | v137.39,295.02 137.29,295.02 136.4,294.13 120.65,294.13 v120.02,294.77 | R27.2 141.22,270.51 | 141.22,270.51 140.72,270 | 141.22,270.51 140.72,271.02 | TP9.TESTPOINT 141.22,273.3 | 141.22,273.3 140.72,272.8 | 141.22,273.3 140.72,273.81 | v114.43,294.77 v117.73,294.77 | v111.63,294.77 109.98,293.12 | 109.98,293.12 U26.4 | v106.93,288.29 106.93,286.51 101.09,280.67 U28.4 | 109.98,293.12 107.19,290.32 v106.93,290.32 | U27.4 157.98,309.87 v153.29,305.18 | v137.03,148.84 v141.48,148.84 | v144.53,148.84 144.78,148.84 145.8,149.86 147.57,149.86 147.84,149.6 U29.4 | v132.72,68.83 U31.4 | U30.4 v122.42,74.41 v122.43,74.42 | v149.86,184.91 150.62,185.67 | 150.62,185.67 148.84,185.67 147.57,184.4 136.65,184.4 v125.22,172.97 | v147.32,191.77 147.32,191.52 147.06,191.25 U32.4
  Bottom 0.254: J3.22 212.78,209.73 209.55,206.5 209.55,205.49 v200.91,196.85 | v125.22,172.97 v125.22,169.54 | v125.22,161.42 v125.22,157.1 | v127.89,148.84 v130.68,148.84 | v134.24,148.84 v137.03,148.84 | v125.73,144.27 v125.73,142.37 | v124.97,90.81 v124.97,87.5 | v124.97,81.41 v124.97,78.61 | v148.21,305.18 v153.29,305.18 | v141.1,296.04 141.1,295.66 140.46,295.02 v137.39,295.02 | v120.02,294.77 v117.73,294.77 | v114.43,294.77 v111.63,294.77 | v106.93,290.32 v106.93,288.29 | v141.48,148.84 v144.53,148.84 | v122.43,74.42 v124.97,74.42 130.56,68.83 v132.72,68.83 | v147.32,191.77 149.86,189.23 v149.86,184.91
!SMBALERT  (via drill 0.6)
  Top 0.254: J3.6 214.2,265.61 214.63,265.18 214.63,201.93 197.36,184.66 196.09,184.66 | 196.09,184.66 171.45,184.66 167.89,181.1 140.97,181.1 134.87,175.01 v134.87,172.85 | v93.22,160.02 92.71,159.51 73.91,159.51 69.34,164.08 55.37,164.08 52.58,166.88 52.58,168.71 J4.6 | v106.3,159.51 134.62,159.51 135.64,160.53 135.64,168.28 v134.37,169.54 | v97.28,160 97.77,159.51 v104.01,159.51 | 196.09,184.66 v196.98,185.55 | R48.1 217.42,184.15 | TP3.TESTPOINT 217.57,186.8 R48.1 | R48.1 v218.69,184.15
  Bottom 0.254: v134.87,172.85 134.87,170.05 v134.37,169.54 | v93.22,160.02 93.83,160.02 94.08,159.77 96.47,159.77 96.7,160 v97.28,160 | v106.3,159.51 v104.01,159.51 | v196.98,185.55 198.37,184.15 v218.69,184.15
!USB_RESET  (via drill 0.6)
  Top 0.254: U1.6 119.38,190.25 v118.87,190.75 | U32.9 143.52,193.3 v144.27,194.06 146.81,194.06 v147.32,193.55 | v149.35,193.55 149.72,193.18 R52.1 150.92,193.23 U33.1
  Bottom 0.254: v118.87,190.75 118.87,190.25 123.19,185.93 124.97,185.93 125.6,185.29 132.72,185.29 140.97,193.55 143.76,193.55 v144.27,194.06 | v147.32,193.55 v149.35,193.55
!WATCHDOG  (via drill 0.41)
  Top 0.254: v88.9,156.97 88.39,157.48 72.9,157.48 68.33,162.05 54.36,162.05 50.55,165.86 49.02,165.86 47.73,167.16 47.7,167.13 44.7,167.13 43.69,168.15 v43.69,169.93 | v88.9,161.54 88.9,185.93 85.85,188.98 85.85,190.46 v85.75,190.61 | v88.14,199.9 88.14,204.72 101.85,218.44 v105.66,218.44 | v109.22,218.44 v111.51,218.44 | v115.06,218.44 v117.09,218.44 | v120.65,218.44 v123.95,218.44 | J3.7 211.61,268 210.31,266.7 210.31,257.56 203.45,250.7 165.1,250.7 v162.56,248.16 | v160.27,245.62 160.27,245.36 v155.7,240.79 | v127.51,218.44 136.65,218.44 155.7,237.49 v155.7,239.01
  Bottom 0.254: v88.9,156.97 v88.9,161.54 | v85.75,190.61 85.75,191.92 88.14,194.31 v88.14,199.9 | v105.66,218.44 v109.22,218.44 | v111.51,218.44 v115.06,218.44 | v117.09,218.44 v120.65,218.44 | v123.95,218.44 v127.51,218.44 | v162.56,248.16 162.56,247.9 v160.27,245.62 | v155.7,240.79 v155.7,239.01 | J4.16 39.95,168.73 41.15,169.93 v43.69,169.93
CONT_MOD0_IN  (via drill 0.6)
  Top 0.254: J3.9 209.07,285.22 202.44,291.85 141.86,291.85 v141.6,291.59 | v138.3,291.59 138.68,291.97 138.68,328.93 131.06,336.55 120.4,336.55 v120.02,336.17 | U8.2 103.63,336.55 v104.01,336.17 | v109.6,336.17 109.98,336.55 111.76,336.55 v112.14,336.17 | v114.43,336.17 114.81,336.55 117.35,336.55 v117.73,336.17
  Bottom 0.254: v141.6,291.59 v138.3,291.59 | v104.01,336.17 104.39,336.55 109.22,336.55 v109.6,336.17 | v112.14,336.17 112.52,336.55 114.05,336.55 v114.43,336.17 | v117.73,336.17 118.11,336.55 119.63,336.55 v120.02,336.17
CONT_MOD0_OUT  (via drill 0.6)
  Top 0.254: J3.10 209.07,265.66 207.77,266.95 207.77,268.73 208.53,269.49 208.53,284.99 202.18,291.34 142.62,291.34 v141.6,290.32 | v138.3,290.32 138.3,290.47 137.49,291.29 137.49,291.9 138.18,292.58 138.18,328.68 130.81,336.04 125.22,336.04 v124.33,335.15 | v109.6,343.41 v112.01,343.41 | v114.94,343.41 v117.22,343.41 | v104.01,343.41 U14.2 | v122.81,341.25 122.68,341.25 v120.52,343.41
  Bottom 0.254: v141.6,290.32 v138.3,290.32 | v104.01,343.41 v109.6,343.41 | v112.01,343.41 v114.94,343.41 | v117.22,343.41 v120.52,343.41 | v124.33,335.15 124.33,339.73 v122.81,341.25
CONT_MOD1_IN  (via drill 0.6)
  Top 0.254: J3.11 206.53,268.25 208.03,269.75 208.05,284.71 201.93,290.83 169.67,290.83 v169.16,290.32 | v148.21,314.71 148.34,314.83 148.34,326.9 v150.62,329.18 | v152.15,334.26 151.64,334.77 151.64,345.19 156.21,349.76 156.72,349.76 v157.23,349.25 | U9.2 v157.23,351.54 | v169.16,294.13 168.91,294.13 168.4,294.64 162.05,294.64 151.64,305.05 151.64,311.15 v152.91,312.42
  Bottom 0.254: v169.16,290.32 v169.16,294.13 | v150.62,329.18 150.62,330.2 151.64,331.22 151.64,333.76 v152.15,334.26 | v157.23,349.25 v157.23,351.54 | v148.21,314.71 150.62,314.71 v152.91,312.42
CONT_MOD1_OUT  (via drill 0.6)
  Top 0.254: J3.12 206.53,265.66 205.23,266.95 205.23,268.73 207.52,271.02 207.52,284.48 201.68,290.32 170.43,290.32 v169.16,289.05 | v149.61,329.95 149.61,328.93 147.83,327.15 147.83,315.72 147.32,315.21 v147.32,313.69 | v152.65,335.53 152.15,336.04 152.15,341.12 156.71,345.69 U15.2 | v167.89,293.75 167.77,293.75 167.39,293.37 162.56,293.37 151.13,304.8 151.13,312.04 v151.51,312.42
  Bottom 0.254: v169.16,289.05 168.15,290.07 168.15,290.58 168.66,291.08 168.66,292.99 v167.89,293.75 | v149.61,329.95 151.13,331.47 151.13,334.77 151.89,335.53 v152.65,335.53 | v147.32,313.69 150.24,313.69 v151.51,312.42
CONT_MOD2_IN  (via drill 0.6)
  Top 0.254: J3.13 203.99,267.49 202.69,266.19 202.69,264.92 189.99,252.22 159.77,252.22 159.51,252.48 158.37,252.48 v158.24,252.35 | U10.2 111.76,239.02 v112.14,238.63 | v114.43,238.63 114.81,239.01 117.35,239.01 v117.73,238.63 | v120.02,238.63 120.4,239.01 124.71,239.01 v125.09,238.63 | v127.38,238.63 127,239.01 127,249.68 127.38,250.06 128.27,250.06 128.65,249.68 155.57,249.68 v155.96,250.06
  Bottom 0.254: v112.14,238.63 v114.43,238.63 | v117.73,238.63 v120.02,238.63 | v125.09,238.63 v127.38,238.63 | v155.96,250.06 v158.24,252.35
CONT_MOD2_OUT  (via drill 0.6)
  Top 0.254: J3.14 203.99,265.45 190.25,251.71 159.26,251.71 v159.13,251.59 | v112.14,249.18 v112.14,249.17 v109.86,249.17 | v114.43,249.17 v117.73,249.17 | v120.02,249.17 v125.09,249.17 | v127.89,249.17 v156.72,249.17 | U16.2 v107.56,249.18 v107.57,249.17
  Bottom 0.254: v112.14,249.17 v114.43,249.17 | v117.73,249.17 v120.02,249.17 | v125.09,249.17 v127.89,249.17 | v156.72,249.17 v159.13,251.59 | v107.57,249.17 v109.86,249.17
CONT_MOD5_IN  (via drill 0.6)
  Top 0.254: J3.15 205.74,272.44 205.74,280.8 v206.63,281.69 | v210.95,281.69 221.49,271.14 221.49,265.43 236.73,250.19 236.73,184.91 v235.71,183.9 | U11.2 150.62,143.76 146.81,139.95 146.81,132.08 151.89,127 176.78,127 234.44,184.66 v234.44,185.42
  Bottom 0.254: v206.63,281.69 v210.95,281.69 | v235.71,183.9 v234.44,185.42
CONT_MOD5_OUT  (via drill 0.6)
  Top 0.254: J3.16 202.69,266.85 202.69,268.73 206.63,272.67 v206.63,280.42 | v210.95,280.42 220.98,270.38 220.98,265.18 236.22,249.94 236.22,185.67 177.04,126.49 151.64,126.49 146.3,131.83 146.3,140.21 150.37,144.27 152.65,144.27 153.16,144.78 153.16,147.57 152.4,148.34 152.4,149.86 153.16,150.62 U17.2
  Bottom 0.254: v206.63,280.42 v210.95,280.42
CONT_MOD6_IN  (via drill 0.6)
  Top 0.254: U12.2 103.37,48.01 103.38,48.01 105.79,48.01 107.06,46.74 137.16,46.74 v147.32,36.58 | J3.17 198.91,268.5 203.96,273.56 203.96,280.8 v204.85,281.69 | v217.42,280.42 223.52,274.32 223.52,266.45 238.76,251.21 238.76,192.53 243.33,187.96 243.33,95.25 184.66,36.58 v150.88,36.58
  Bottom 0.254: v204.85,281.69 203.96,280.8 203.96,279.91 204.98,278.89 215.9,278.89 v217.42,280.42 | v150.88,36.58 v147.32,36.58
CONT_MOD6_OUT  (via drill 0.6)
  Top 0.254: U18.2 101.22,55.63 v107.44,49.4 | J3.18 198.91,265.96 200.15,267.21 200.15,268.73 204.85,273.43 v204.85,280.42 | v216.15,280.42 223.01,273.56 223.01,266.19 238.25,250.95 238.25,192.28 242.82,187.71 242.82,95.5 185.17,37.85 v150.88,37.85 | v147.32,37.85 137.54,47.62 v107.44,47.62
  Bottom 0.254: v107.44,49.4 v107.44,47.62 | v204.85,280.42 204.85,280.29 205.74,279.4 215.14,279.4 v216.15,280.42 | v150.88,37.85 v147.32,37.85
CONT_MOD7_IN  (via drill 0.6)
  Top 0.254: v210.95,282.96 222,271.91 222,265.68 237.24,250.44 237.24,191.77 241.81,187.2 241.81,96.01 188.72,42.93 156.34,42.93 v155.96,42.55 | U13.2 154.18,57.4 154.43,57.15 154.43,55.88 153.67,55.12 152.65,55.12 151.64,54.1 151.64,51.94 v151.89,51.69 | v151.89,48.64 152.02,48.64 154.43,46.23 155.07,46.23 v155.96,45.34 | v206.63,282.96 204.85,282.96 203.2,281.31 203.2,274.98 J3.19
  Bottom 0.254: v151.89,51.69 v151.89,48.64 | v155.96,45.34 v155.96,42.55 | v210.95,282.96 v206.63,282.96
CONT_MOD7_OUT  (via drill 0.6)
  Top 0.254: v210.95,284.23 222.5,272.67 222.5,265.94 237.74,250.7 237.74,192.02 242.32,187.45 242.32,95.76 188.98,42.42 157.1,42.42 156.34,41.66 155.45,41.66 v154.56,42.55 | U19.2 152.9,64.26 150.37,61.72 150.37,58.8 v150.62,58.55 | v150.62,56.01 150.62,55.88 150.37,55.63 150.37,51.94 v150.62,51.69 | v150.75,48.9 150.75,48.39 151.89,47.24 152.65,47.24 v154.56,45.34 | v206.63,284.23 205.49,284.23 202.69,281.43 202.69,275.08 196.85,269.24 195.83,269.24 195.07,268.48 195.07,266.9 J3.20
  Bottom 0.254: v150.62,58.55 v150.62,56.01 | v150.62,51.69 150.62,49.02 v150.75,48.9 | v154.56,45.34 v154.56,42.55 | v210.95,284.23 v206.63,284.23
CONT_USB+
  Top 0.254: 123.19,188.72 121.41,188.72 121.38,188.75 U1.3 | 123.19,188.72 128.02,188.72 136.4,197.1 195.07,197.1 206.5,208.53 206.5,211.02 J3.27 | R25.1 123.84,188.07 123.19,188.72
CONT_USB-
  Top 0.254: U1.4 121.18,189.25 121.41,189.23 127.76,189.23 136.14,197.61 194.82,197.61 198.37,201.17 198.37,201.93 199.14,202.69 199.9,202.69 200.66,203.45 200.66,204.22 201.42,204.98 202.18,204.98 202.95,205.74 202.95,206.5 203.71,207.26 204.47,207.26 205.26,208.05 J3.28
GND  (via drill 0.41, 0.6)
  Top 0.203: U20.10 106.03,361.3 | U20.4 v109.98,361.7 v111.25,361.7 112.01,361.7 112.08,361.62 D1.3 | U21.4 v121.92,362.2 | D1.5 118.98,360.32 | 118.98,360.32 v119.63,359.66 | 118.98,360.32 118.98,360.28 v118.36,359.66 | U21.10 126.13,362.6 126.24,362.71 v126.24,363.47 | U3.4 158.1,338.18 | U25.4 v146.3,89.15 | U24.4 v97.92,88.52 | U7.4 154.16,49.89 | U5.4 154.29,136.25 154.05,136.02 | U23.10 156.09,175.4 | v152.91,174.75 U23.4 v151.64,174.75 | U25.10 150.26,89.55 150.37,89.66 | U6.4 98.95,63.65 | U24.10 94.22,88.12 93.85,87.76 v93.85,87.25 | U22.4 v96.77,228.73 | C78.1 90.28,227.82 v90.17,227.71 v91.69,227.71 92.31,228.33 U22.10 | U4.4 103.78,259.99 v104.39,260.6 | U2.4 97.68,350.67 v98.04,351.03
  Top 0.254: 106.03,361.3 105.52,360.79 C76.1 103.77,360.79 v103.38,361.19 v103.38,362.46 | D1.1 113.18,363.58 | 113.18,363.58 v112.52,364.24 | 113.18,363.58 113.39,363.58 v114.05,364.24 | D1.7 120.58,362.27 v120.65,362.2 v121.92,362.2 | v126.24,363.47 126.38,363.62 C77.1 128.67,363.62 v128.78,363.73 | C71.2 v149.1,359.92 149.61,359.41 v150.37,359.41 150.88,358.9 | S14.1 150.93,358.85 150.88,358.9 | 150.88,358.9 151.38,359.41 v152.15,359.41 152.91,358.65 | S14.PAD 152.91,358.65 | v153.67,359.41 152.91,358.65 | C40.2 162.96,354.73 v163.07,354.84 | C34.2 v155.7,347.98 | C46.2 162.45,348.88 v162.56,349 | U9.4 158.47,349.53 v158.5,349.5 | C16.2 v156.21,341.38 | U15.4 v157.24,344.69 v157.23,344.68 | U15.5 v162.8,344.69 v162.81,344.68 | C22.2 164.48,334.15 v164.59,334.26 | R71.1 157.88,335.65 v157.73,335.53 | 158.1,338.18 v157.48,337.57 | v153.16,322.83 C53.2 153.78,321.71 154.69,320.79 U27.17 | R53.1 v110.49,357.89 | R54.1 v110.49,365.51 | R56.1 v121.41,358.39 | R55.1 v121.41,366.01 | C83.2 159.12,342.53 v159,342.65 | C85.2 158.35,140.1 v158.5,139.95 | C18.2 153.56,140.1 v153.42,139.95 | C42.2 158.86,146.95 v159,146.81 | C48.2 159.4,154.57 v159.77,154.18 | v158.5,156.21 157.08,156.21 R78.1 | R76.1 v159,132.33 | C24.2 159.4,130.95 v159.51,131.06 | R59.1 v148.84,178.05 | R19.2 v151.13,176.78 | D4.3 108.13,89.22 v108.2,89.28 v109.47,89.28 | D4.7 99.24,88.58 v99.19,88.52 v97.92,88.52 | C87.2 157.62,54.24 v157.73,54.36 | C20.2 152.77,53.74 v152.65,53.85 | R82.1 v152.65,39.62 | R83.1 v157.73,47.75 | 154.16,49.89 v153.67,49.4 | U13.4 152.92,56.4 v152.53,56.01 | C26.2 150.73,45.1 | 150.73,45.1 v150.75,45.09 151,45.09 151.73,44.36 S6.2
  Top 0.254: C63.2 v164.34,81.79 | C44.2 158.74,61.1 v159,61.34 | v156.08,59.94 C32.2 | U19.5 157.85,63.26 v157.86,63.25 | C38.2 150.86,63.61 v150.62,63.37 | C93.2 152.16,131.97 v152.15,131.95 | v153.16,135.38 153.42,135.38 154.05,136.02 | U11.4 153.17,142.76 v152.65,142.24 | U17.5 157.98,149.62 v157.99,149.61 | C61.2 v160.53,165.35 | 156.09,175.4 v156.72,176.02 | C79.1 159.12,176.26 v159.13,176.28 | D3.3 140.9,171.12 v140.84,171.2 v139.57,171.2 | C2.1 113.41,181.61 v112.52,180.72 | S16.PAD 150.16,162.77 S16.1 148.38,162.77 148.08,163.07 v148.08,163.83 | S10.2 152.78,156.97 v152.53,157.23 | v150.5,90.3 150.5,89.79 150.37,89.66 | C81.1 v154.18,89.15 | v149.61,73.15 150.16,72.6 S18.1 151.93,72.6 S18.PAD | C69.2 v147.32,70.36 | C50.2 159.27,68.21 v159.64,67.82 | S12.2 154.43,67.82 154.69,67.56 v154.81,67.56 | C13.2 v106.43,184.66 | C14.2 107.39,188.39 v107.44,188.34 | C12.2 102.18,194.36 v102.23,194.31 | C7.2 105.99,202.77 v105.92,202.69 | C8.2 108.89,203.28 v109.47,202.69 | C3.2 111.83,202.77 v111.76,202.69 | C4.2 114.73,202.74 v114.68,202.69 | C5.2 117.42,202.77 v117.35,202.69 | C6.2 120.32,202.77 v120.4,202.69 | R24.2 146.67,84.98 v146.69,84.71 | R23.2 146.67,93.58 v146.69,93.6 | C94.2 v32,95.76 | v32,90.68 C25.2 | v96.52,59.18 C86.2 | v101.35,60.71 C19.2 | 98.95,63.65 v99.57,64.26 | v93.98,44.83 95.23,44.83 C43.2 | v99.57,44.83 100.82,44.83 C31.2 | v99.57,52.45 100.82,52.45 C37.2 | v93.98,52.45 95.23,52.45 C49.2 | C80.1 91.81,87.77 v92.33,87.25 | C68.2 44.44,97.3 v44.32,97.41 | v96.01,94.11 96,92.84 R22.2 | R21.2 97.39,84.69 v97.41,84.71 | U12.4 99.94,49.01 v100.58,49.66 | U18.4 100.83,56.63 v100.84,56.64 | S11.2 v51.18,96.01 | C62.2 v42.42,86.87
  Top 0.254: S17.PAD 39.58,96.73 S17.1 39.58,98.51 39.88,98.81 40.39,98.81 v40.64,98.55 40.78,98.69 C74.2 v41.91,99.82 | R79.1 25.51,93.58 v25.53,93.6 | v48.26,90.68 R81.1 | D2.7 98.1,228.78 v98.04,228.73 v96.77,228.73 | R17.2 96.5,224.9 v96.52,224.92 | R18.2 96.5,232.81 v96.52,232.79 | C41.2 v100.33,234.31 | v104.9,234.31 C29.2 | v104.9,244.47 C35.2 | v100.33,244.47 C47.2 | C84.2 v101.35,254.89 | C17.2 v103.89,254.89 | v43.43,281.69 C60.2 | v59.94,282.45 C66.2 | C72.2 58.05,283.61 v57.91,283.46 | v55.12,282.19 54.57,282.74 S15.1 52.54,282.74 52.07,283.21 | S15.PAD v51.56,281.69 | C23.2 96.66,268.62 v96.27,268.22 | v99.06,269.24 R73.1 | v105.66,262.38 R74.1 | v102.62,317.5 C90.2 | v102.62,320.8 C21.2 | S13.1 94.04,314.25 v93.98,314.2 | S13.PAD v93.98,316.23 | C58.2 v91.95,329.18 | C82.2 94.6,346.82 v94.49,346.71 | v98.55,345.95 C15.2 | R68.1 95.11,353.46 v95,353.57 | C39.2 93.87,332.85 v93.47,333.25 | C45.2 93.61,339.71 v93.47,339.85 | C33.2 99.43,339.71 v99.57,339.85 | v98.81,304.29 R69.1 | C64.2 99.57,306.83 v98.81,306.07 | S7.2 v106.43,305.56 | C96.1 v125.73,192.79 | C51.1 124.35,190.64 124.71,191.01 v125.73,191.01 | D2.5 99.72,230.65 | 99.72,230.65 v100.33,231.27 | 99.72,230.65 99.67,230.65 v99.06,231.27 | D2.1 106.47,228.13 v107.19,228.85 106.61,229.43 D2.3 | R75.1 99.82,262.89 100.58,262.13 v100.58,261.62 | U16.5 99.71,250.18 v99.57,250.32 | U16.4 105.53,250.18 v105.66,250.32 | U14.5 v93.23,344.41 v93.22,344.42 | U14.4 v99.3,344.41 v99.31,344.42 | S9.2 65.79,285.5 v66.04,285.24 | R61.1 97.17,103.87 v97.03,104.01 | v116.84,85.98 R64.1 | R63.1 v116.84,92.33 | C10.2 105.74,176.48 v105.54,176.28 | C9.2 v109.6,177.29 | U10.4 104.76,240.02 v105.41,240.66
  Top 0.254: v102.36,223.52 R57.1 | C70.2 93.84,310.5 v93.73,310.39 | U8.4 98.79,337.55 v99.31,338.07 | D4.5 99.61,89.88 v99.06,90.42 v97.79,90.42 | D4.1 107.4,87.92 v108.2,87.12 v109.47,87.12 | D3.1 142.28,172.43 141.48,173.23 v140.72,173.23 v139.45,173.23 | R67.1 107.81,313.29 v107.7,313.18 | S8.2 151.89,350.52 v152.4,351.03 | C65.2 151.64,353.06 v152.4,352.3 | C28.2 159.65,353.17 v160.02,352.81 | C91.2 156.72,329.69 v157.48,328.93 | R70.1 161.18,327.77 161.54,327.41 v161.54,326.64 | v98.04,331.72 C27.2 | C73.2 147.69,164.23 v148.08,163.83 | v148.08,163.83 148.34,163.83 v149.1,164.59 | R77.1 v157.99,134.37 | S1.PAD 106.93,319.53 v106.17,318.77 106.17,319.79 106.64,320.26 S1.2 | S2.2 160.78,331.97 161.04,332.23 161.04,332.49 v160.53,332.99 159.77,332.23 S2.PAD | S3.2 94.48,271.53 94.74,271.27 95.5,271.27 v95.76,271.53 95.76,271.78 95,272.54 S3.PAD | S4.PAD 155.19,129.54 v155.96,130.3 156.46,129.79 156.46,129.54 156.21,129.28 S4.2 | S5.2 29.21,92.21 29.46,91.95 v30.23,91.95 30.23,92.71 29.72,93.22 S5.PAD | S6.PAD 151,44.32 150.73,44.59 150.73,45.1 | v115.57,184.91 115.82,184.91 116.33,185.42 U1.43 | C1.1 120.65,182.12 121.28,181.48 v121.28,180.85 | LED1001.C v87.12,314.71 | LED1002.C v87.12,310.64 | LED1003.C v87.12,306.58 | LED1009.C v87.38,260.1 | LED1008.C v87.38,264.16 | LED1007.C v87.38,268.22 | v90.42,275.08 C92.2 | v87.38,66.04 LED1015.C | v87.38,70.36 LED1014.C | v87.38,74.42 LED1013.C | R1018.1 R1017.1 178.7,70.61 | 178.7,70.61 R1016.1 | v166.62,71.12 178.2,71.12 178.7,70.61 | R1010.1 R1011.1 178.7,116.33 | 178.7,116.33 R1012.1 | v166.62,115.95 178.32,115.95 178.7,116.33 | C75.2 147.18,73.01 v147.32,73.15
  Top 0.254: R84.1 v162.31,64.52 | R72.1 141.59,353.2 v141.48,353.31 | R20.2 153.56,171.31 v153.42,171.45 | R58.1 v106.93,226.57 | R60.1 v150.62,171.45 | D3.7 147.14,171.78 v146.56,171.2 147.28,170.47 D3.5 | R65.2 98.16,185.79 99.06,186.69 v99.06,187.2 99.57,187.2 99.82,187.45 R66.2 | C11.2 100.41,191.84 v100.08,191.52 | v152.78,62.48 152.78,62.87 153.16,63.25 153.63,63.25 U19.4 | C67.2 151.5,156.61 v151.38,156.72 | C95.2 146.67,43.32 v147.57,42.42 | R62.1 93.33,103.87 v93.47,104.01 | R15.2 v124.46,367.03 | R16.2 v124.46,356.87 | C59.2 164.96,359.81 v165.1,359.66 | U28.17 104.13,277.38 104.65,276.86 v104.65,275.84 105.27,276.46 C54.2 | v100.58,288.29 C52.2 101.71,288.91 102.88,290.08 U26.17 | U27.2 156.98,317.51 v156.46,316.99 156.48,317.01 U27.1 | U17.4 153.17,149.62 152.91,149.35 152.91,149.1 v153.42,148.59 | U29.17 150.61,146.82 150.88,146.56 150.88,145.54 v150.62,145.29 150.99,145.65 C55.2 | C30.2 155.96,146.56 v156.46,147.07 | U29.2 148.84,150.12 148.59,150.37 v148.59,150.88 | C36.2 155.7,152.91 v155.96,152.65 | v139.7,73.66 C57.2 138.57,72.79 137.66,71.87 U31.17 | v99.06,66.55 98.16,66.55 R80.1 | v95.76,69.34 C56.2 96.89,70.72 97.04,70.87 U30.17 | U28.3 101.6,280.42 103.38,282.19 v104.9,282.19 104.9,280.67 104.39,280.16 102.87,280.16 102.6,279.89 U28.1 | U26.1 106.19,291.61 v106.68,292.1 | U26.3 106.17,292.61 v106.68,292.1 | U26.2 v106.67,292.11 v106.68,292.1 | U30.3 100.84,73.91 v101.35,73.41 | U1.24 113.33,193.38 v113.41,193.29 | U1.48 118.83,183.69 v119,183.51 | U1.5 121.3,189.75 v121.67,190.12 | U32.17 143.52,186.59 C88.2 v141.99,186.18 | U32.1 146.54,189.75 v147.07,189.23 | v152.65,190.25 152.65,190.75 153.23,191.33 U33.3
  Top 0.254: 158.24,286.38 157.99,286.38 | U34.4 156.72,287.65
  Top 0.305: R14.2 v107.7,367.03 | R13.2 v107.7,355.85
  Top 0.508: R1006.1 R1005.1 R1004.1 178.7,316.09 177.55,317.25 166.37,317.25 v165.61,318.01 | H3.B#4 164.13,370.89 v161.29,368.05 | J1.MNT4 250.16,306.6 v250.19,306.58 | J3.MNT2 250.11,268.15 v250.19,268.22 | U34.3 157.99,286.38 156.72,287.65 | H7.B#4 163.14,286.38 158.24,286.38 156.97,285.12 U34.2 | C89.2 v147.57,281.69
  Top 0.61: v162.56,361.95 162.44,361.83 C98.2 159.13,361.83 v159,361.95 | 95,329.95 v94.23,330.71 | C97.2 95,329.95 | 95,329.95 v95.76,330.71 | v33.27,283.97 34.04,283.21 C99.2 33.78,283.21 v33.27,282.7 | 157.48,167.13 v158.24,167.89 | C100.2 157.48,167.13 | 157.48,167.13 v156.72,167.89 | 43.94,89.66 v44.7,90.42 | C101.2 43.94,89.66 | 43.94,89.66 v44.7,88.9 | 161.54,82.8 v162.31,83.57 | C102.2 161.54,82.8 | 161.54,82.8 v160.78,83.57
  Bottom 0.254: v87.38,260.1 v87.38,264.16 v87.38,268.22 87.38,275.34 88.39,276.35 90.17,276.35 | v160.53,165.35 160.53,166.37 158.5,168.4 | 37.08,362.46 38.56,362.46 J0.14 | 87.1,306.6 v87.12,306.58 | J3.MNT1 186.84,273.2 186.94,273.3 | 214.71,209.73 214.63,209.8 | 200.84,209.73 200.91,209.8 | 197.33,74.4 197.36,74.42 | 166.9,15.98 154.69,28.19 154.69,38.35 154.94,38.61 | 35.48,268.15 35.56,268.22 | v147.32,73.15 146.81,73.66 v139.7,73.66 137.16,71.12 U31.GND | U32.GND 144.53,190.75 146.05,192.28 146.05,194.56 | U32.GND 144.02,188.21 v141.99,186.18 | v147.07,189.23 145.54,189.23 U32.GND | v152.65,190.25 152.65,194.56 | 156.21,281.69 156.34,281.56
  Bottom 0.508: 159.77,130.3 166.62,123.44 v166.62,115.95 166.62,114.3 168.07,112.85 J5.MNT3 J5.MNT4 250.01,112.85 250.19,113.03 | 37.08,362.46 34.52,365.02 J0.MNT1 J0.MNT3 | J0.MNT4 J0.MNT3 | J0.MNT4 87.1,306.6 | J1.1 J1.MNT2 J1.MNT4 J1.MNT3 | J3.MNT2 J3.1 | 214.71,209.73 J3.MNT3 250.11,209.73 250.19,209.8 | J3.MNT4 200.84,209.73 | J5.1 J5.MNT2 250.01,171.27 250.19,171.45 | J7.1 J7.MNT2 250.16,74.4 250.19,74.42 | J7.MNT1 197.33,74.4 | J7.MNT3 J7.MNT4 249.96,15.98 250.19,15.75 | J7.MNT3 166.9,15.98 | J6.MNT4 J6.MNT3 | J6.MNT4 75.16,15.98 97.28,38.1 97.28,42.16 | J6.MNT2 J6.1 | J6.MNT3 J6.MNT1 4.04,74.4 3.81,74.17 | J4.1 J4.MNT2 67.18,150.88 73.53,144.53 73.53,130.05 67.16,123.67 J4.MNT4 J4.MNT3 3.99,112.85 3.81,113.03 | J4.MNT1 J2.MNT3 J2.MNT4 67.16,192.68 70.61,189.23 | J2.1 J2.MNT2 J0.MNT4 | 35.48,268.15 J2.MNT1 J0.MNT3 | 67.06,3.81 H18.B#4 H19.B#4 186.69,3.81 | 25.4,3.81 67.06,3.81 | 25.4,3.81 H17.B#4 3.81,74.17 | 186.69,3.81 H20.B#4 250.19,15.75 | 250.19,15.75 250.19,74.42 | 250.19,74.42 H16.B#4 250.19,113.03 | 250.19,171.45 H12.B#4 250.19,209.8 | 250.19,113.03 250.19,171.45 | 250.19,209.8 v250.19,268.22 H8.B#4 v250.19,306.58 H4.B#4 H3.B#4 H2.B#4 H1.B#4 H5.B#4 H9.B#4 3.81,132.08 2.54,130.81 2.54,129.54 3.81,128.27 3.81,113.03 | 3.81,74.17 H13.B#4 3.81,113.03 | H6.B#4 99.67,287.38 v100.58,288.29 | J7.MNT3 186.84,3.96 186.69,3.81 | H7.B#4 162.15,287.38 | H11.B#4 164.13,194.77 163.83,195.07 | J6.MNT4 67.16,3.91 67.06,3.81 | J6.MNT3 25.25,3.96 25.4,3.81 | v147.57,281.69 156.21,281.69
  Bottom 0.61: 95.76,302.51 95.76,297.18 97.03,295.91 | 95.76,302.51 97.54,304.29 v98.81,304.29 v98.81,306.07 | 95.76,302.51 95.76,308.36 v93.73,310.39 | v87.12,306.58 v87.12,310.64 87.12,312.42 | v87.12,314.71 87.12,312.42 | v93.73,310.39 93.73,313.94 v93.98,314.2 94.04,314.25 94.04,316.17 v93.98,316.23 | 87.12,312.42 91.69,312.42 v93.73,310.39 | v102.62,317.5 104.9,317.5 v106.17,318.77 | v102.62,320.8 104.14,320.8 v106.17,318.77 | v106.17,318.77 109.98,318.77 | v107.7,313.18 109.73,313.18 | v106.43,305.56 107.19,305.56 109.73,308.1 | v107.7,355.85 107.7,357.12 | v87.38,66.04 v87.38,70.36 87.38,72.39 | 87.38,72.39 92.2,72.39 | 87.38,72.39 v87.38,74.42
  Bottom 0.635: 162.15,287.38 156.34,281.56 151.13,276.35
  Bottom 0.813: v99.31,344.42 99.31,345.19 v98.55,345.95
  Bottom 1.27: TP4.TESTPOINT 220.73,181.36 214.12,174.75 | J3.1 219.23,269.47 215.39,273.3 186.94,273.3 TP11.TESTPOINT | TP11.TESTPOINT 153.67,274.32 151.64,276.35 151.13,276.35 121.92,276.35 | TP11.TESTPOINT 153.67,259.08 147.32,252.73 TP7.TESTPOINT
  other vias: 101.6,277.88 103.38,292.61 157.48,320.29 148.34,147.32 137.16,69.34 97.54,73.91 144.02,190.75